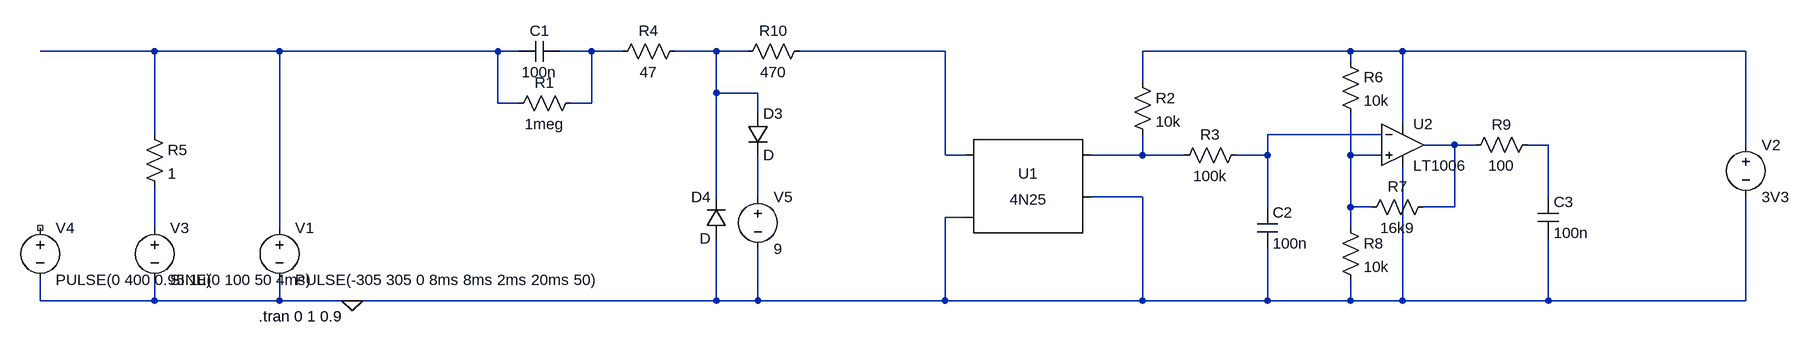
[diagram p0: schematic power-input.asc]
power-input.asc, the LTspice schematic file:
Version 4
SHEET 1 1900 680
WIRE -624 -112 -800 -112
WIRE -432 -112 -624 -112
WIRE -96 -112 -432 -112
WIRE -64 -112 -96 -112
WIRE 48 -112 0 -112
WIRE 96 -112 48 -112
WIRE 240 -112 176 -112
WIRE 288 -112 240 -112
WIRE 592 -112 368 -112
WIRE 1216 -112 896 -112
WIRE 1296 -112 1216 -112
WIRE 1824 -112 1296 -112
WIRE 1216 -96 1216 -112
WIRE 896 -64 896 -112
WIRE 240 -48 240 -112
WIRE 304 -48 240 -48
WIRE -96 -32 -96 -112
WIRE -64 -32 -96 -32
WIRE 48 -32 48 -112
WIRE 48 -32 16 -32
WIRE 304 -16 304 -48
WIRE 1296 0 1296 -112
WIRE -624 16 -624 -112
WIRE 1264 16 1088 16
WIRE 1376 32 1328 32
WIRE 1408 32 1376 32
WIRE 1520 32 1488 32
WIRE 1824 32 1824 -112
WIRE 592 48 592 -112
WIRE 624 48 592 48
WIRE 896 48 896 16
WIRE 896 48 816 48
WIRE 960 48 896 48
WIRE 1088 48 1088 16
WIRE 1088 48 1040 48
WIRE 1216 48 1216 -16
WIRE 1264 48 1216 48
WIRE 240 112 240 -48
WIRE 304 112 304 48
WIRE 896 112 816 112
WIRE 1520 112 1520 32
WIRE 1088 128 1088 48
WIRE 1216 128 1216 48
WIRE 1248 128 1216 128
WIRE 1376 128 1376 32
WIRE 1376 128 1328 128
WIRE 624 144 592 144
WIRE -624 160 -624 96
WIRE -432 160 -432 -112
WIRE 1216 160 1216 128
WIRE -800 272 -800 240
WIRE -624 272 -624 240
WIRE -624 272 -800 272
WIRE -432 272 -432 240
WIRE -432 272 -624 272
WIRE -320 272 -432 272
WIRE 240 272 240 176
WIRE 240 272 -320 272
WIRE 304 272 304 192
WIRE 304 272 240 272
WIRE 592 272 592 144
WIRE 592 272 304 272
WIRE 896 272 896 112
WIRE 896 272 592 272
WIRE 1088 272 1088 192
WIRE 1088 272 896 272
WIRE 1216 272 1216 240
WIRE 1216 272 1088 272
WIRE 1296 272 1296 64
WIRE 1296 272 1216 272
WIRE 1520 272 1520 176
WIRE 1520 272 1296 272
WIRE 1824 272 1824 112
WIRE 1824 272 1520 272
FLAG -320 272 0
SYMBOL voltage -432 144 R0
WINDOW 123 0 0 Left 2
WINDOW 39 0 0 Left 2
SYMATTR InstName V1
SYMATTR Value PULSE(-305 305 0 8ms 8ms 2ms 20ms 50)
SYMBOL cap 0 -128 R90
WINDOW 0 0 32 VBottom 2
WINDOW 3 32 32 VTop 2
SYMATTR InstName C1
SYMATTR Value 100n
SYMBOL res 32 -48 R90
WINDOW 0 0 56 VBottom 2
WINDOW 3 32 56 VTop 2
SYMATTR InstName R1
SYMATTR Value 1meg
SYMBOL Optos\\4N25 720 112 R0
SYMATTR InstName U1
SYMBOL res 880 -80 R0
SYMATTR InstName R2
SYMATTR Value 10k
SYMBOL res 1056 32 R90
WINDOW 0 0 56 VBottom 2
WINDOW 3 32 56 VTop 2
SYMATTR InstName R3
SYMATTR Value 100k
SYMBOL cap 1072 128 R0
SYMATTR InstName C2
SYMATTR Value 100n
SYMBOL voltage 1824 16 R0
WINDOW 123 0 0 Left 2
WINDOW 39 0 0 Left 2
SYMATTR InstName V2
SYMATTR Value 3V3
SYMBOL voltage -624 144 R0
WINDOW 123 0 0 Left 2
WINDOW 39 0 0 Left 2
SYMATTR InstName V3
SYMATTR Value SINE(0 100 50 4ms)
SYMBOL res -640 0 R0
SYMATTR InstName R5
SYMATTR Value 1
SYMBOL Opamps\\LT1006 1296 -32 R0
SYMATTR InstName U2
SYMBOL res 1344 112 R90
WINDOW 0 0 56 VBottom 2
WINDOW 3 32 56 VTop 2
SYMATTR InstName R7
SYMATTR Value 16k9
SYMBOL res 1200 -112 R0
SYMATTR InstName R6
SYMATTR Value 10k
SYMBOL res 1200 144 R0
SYMATTR InstName R8
SYMATTR Value 10k
SYMBOL res 1504 16 R90
WINDOW 0 0 56 VBottom 2
WINDOW 3 32 56 VTop 2
SYMATTR InstName R9
SYMATTR Value 100
SYMBOL cap 1504 112 R0
SYMATTR InstName C3
SYMATTR Value 100n
SYMBOL voltage -800 144 R0
WINDOW 123 0 0 Left 2
WINDOW 39 0 0 Left 2
SYMATTR InstName V4
SYMATTR Value PULSE(0 400 0.95 1u)
SYMBOL res 384 -128 R90
WINDOW 0 0 56 VBottom 2
WINDOW 3 32 56 VTop 2
SYMATTR InstName R10
SYMATTR Value 470
SYMBOL res 192 -128 R90
WINDOW 0 0 56 VBottom 2
WINDOW 3 32 56 VTop 2
SYMATTR InstName R4
SYMATTR Value 47
SYMBOL diode 288 -16 R0
SYMATTR InstName D3
SYMBOL diode 256 176 R180
WINDOW 0 24 64 Left 2
WINDOW 3 24 0 Left 2
SYMATTR InstName D4
SYMBOL voltage 304 96 R0
WINDOW 123 0 0 Left 2
WINDOW 39 0 0 Left 2
SYMATTR InstName V5
SYMATTR Value 9
TEXT -464 296 Left 2 !.tran 0 1 0.9

The netlist it stands for:
* power-input.asc
V1 N001 0 PULSE(-305 305 0 8ms 8ms 2ms 20ms 50)
C1 N002 N001 100n
R1 N002 N001 1meg
XU1 N004 0 N009 0 NC_01 4N25
R2 N005 N009 10k
R3 N006 N009 100k
C2 N006 0 100n
V2 N005 0 3V3
V3 N012 0 SINE(0 100 50 4ms)
R5 N001 N012 1
XU2 N010 N006 N005 0 N007 LT1006  ; pins In+ In- V+ V- OUT
R7 N007 N010 16k9
R6 N005 N010 10k
R8 N010 0 10k
R9 N008 N007 100
C3 N008 0 100n
V4 NC_02 0 PULSE(0 400 0.95 1u)
R10 N004 N003 470
R4 N003 N002 47
D3 N003 N011 D
D4 0 N003 D
V5 N011 0 9
.model D D
.lib standard.dio
.tran 0 1 0.9
.lib 4N25.sub
.lib LTC.lib
.backanno
.end